# EAGLE schematic Schnittstelle_Swissphone (EAGLE 9.6.1)
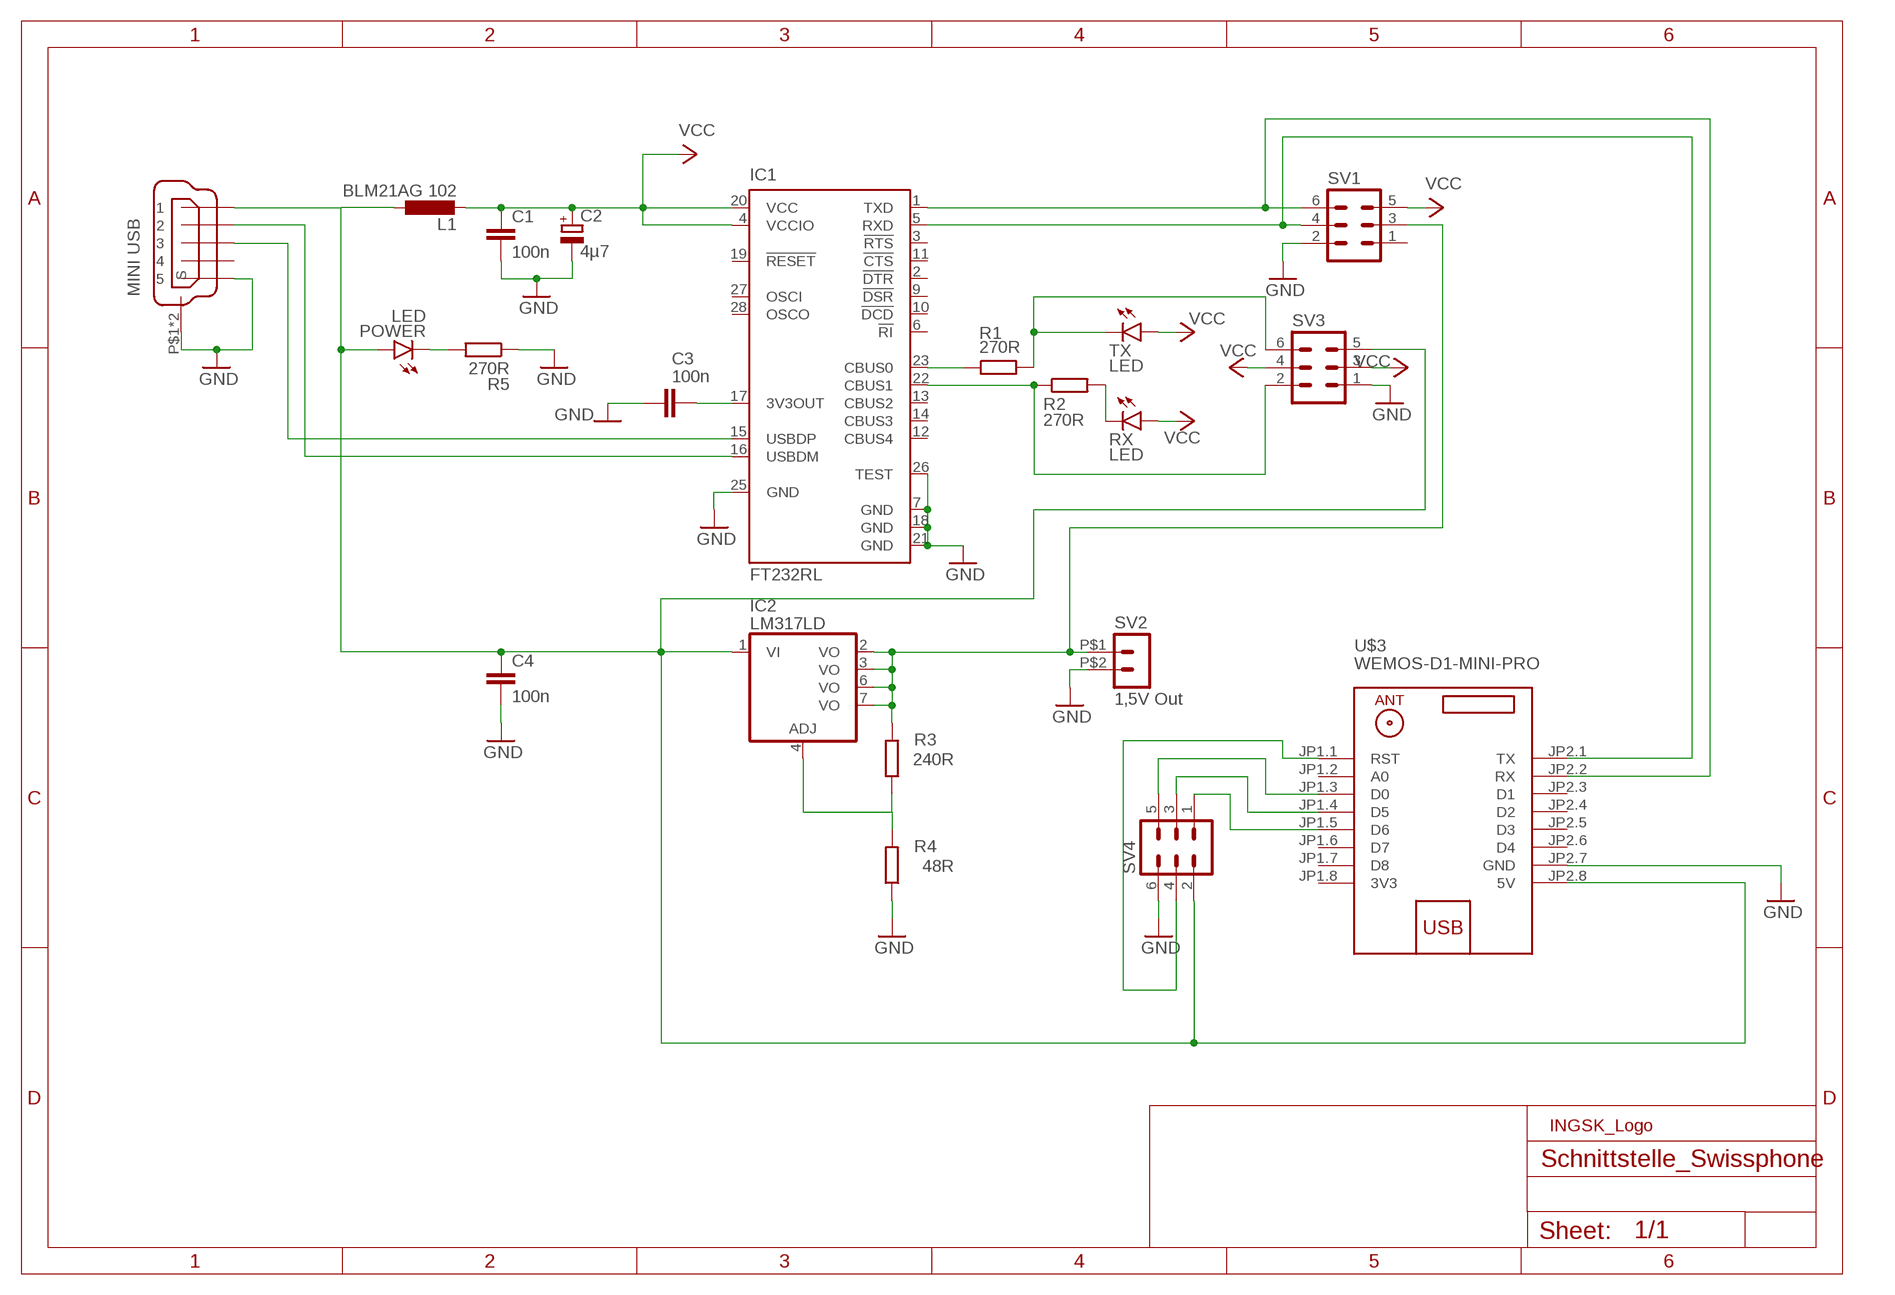
[diagram p0: schematic, sheet 1]

## Parts
C1  100n  C-EUC0603  [C0603]
C2  4µ7  CPOL-EUA/3216-18W  [A/3216-18W]
C3  100n  C-EUC0603  [C0603]
C4  100n  C-EUC0603  [C0603]
IC1  FT232RL  [SSOP28]
IC2  LM317LD  [SO08]
L1  BLM21AG 102  L-EUL2012C  [L2012C]
POWER  LED  LED3MM  [LED3MM]
R1  270R  R-EU_R0603  [R0603]
R2  270R  R-EU_R0603  [R0603]
R3  240R  R-EU_R1206  [R1206]
R4  48R  R-EU_R1206  [R1206]
R5  270R  R-EU_R0603  [R0603]
RX  LED  LED3MM  [LED3MM]
SV1  ML6  [ML6]
SV2  1,5V Out  HEADER_POS2_43650-0200  [43650-0200]
SV3  ML6  [ML6]
SV4  ML6  [ML6]
TX  LED  LED3MM  [LED3MM]
U$1  MINI USB  USBBWM  [USBBWM]
U$2  SK  [INGSK]
U$3  WEMOS-D1-MINI-PRO  [WEMOS-D1-MINI-PRO]

## Nets
GND: C1.2 C2.- C3.2 C4.2 IC1.7(GND) IC1.18(GND) IC1.21(GND) IC1.25(GND) IC1.26(TEST) R4.1 R5.1 SV1.2 SV2.P$2 SV3.1 SV4.6 U$1.P$1(S) U$1.P$2(S) U$1.P$3 U$3.JP2.7(GND)
N$1: IC1.23(CBUS0) R1.1
N$2: IC1.22(CBUS1) R2.1 SV3.2
N$3: R1.2 SV3.6 TX.K(C)
N$4: R2.2 RX.K(C)
N$5: IC1.1(TXD) SV1.6 U$3.JP2.2(RX)
N$6: IC1.5(RXD) SV1.4 U$3.JP2.1(TX)
N$7: IC2.2(VO) IC2.3(VO) IC2.6(VO) IC2.7(VO) R3.2 SV1.3 SV2.P$1
N$8: SV4.1 U$3.JP1.5(D6)
N$9: IC2.4(ADJ) R3.1 R4.2
N$10: C3.1 IC1.17(3V3OUT)
N$11: C4.1 IC2.1(VI) L1.1 POWER.A SV3.5 SV4.2 U$1.P$7 U$3.JP2.8(5V)
N$12: POWER.K(C) R5.2
N$13: IC1.16(USBDM) U$1.P$6
N$14: IC1.15(USBDP) U$1.P$5
N$15: SV4.3 U$3.JP1.4(D5)
N$16: SV4.5 U$3.JP1.3(D0)
N$17: SV4.4 U$3.JP1.1(RST)
VCC: C1.1 C2.+ IC1.4(VCCIO) IC1.20(VCC) L1.2 RX.A SV1.5 SV3.3 SV3.4 TX.A
Unconnected: IC1.2(!DTR) IC1.3(!RTS) IC1.6(!RI) IC1.9(!DSR) IC1.10(!DCD) IC1.11(!CTS) IC1.12(CBUS4) IC1.13(CBUS2) IC1.14(CBUS3) IC1.19(!RESET) IC1.27(OSCI) IC1.28(OSCO) SV1.1 U$1.P$4 U$3.JP1.2(A0) U$3.JP1.6(D7) U$3.JP1.7(D8) U$3.JP2.3(D1) U$3.JP2.4(D2) U$3.JP2.5(D3) U$3.JP2.6(D4)

## Power pins joined to a net without a drawn wire
3V3: U$3.JP1.8(3V3)

## Library data of the parts
C1 C3 C4 = rcl:C-EU: CAPACITOR, European symbol; SPICEPREFIX: C
C2 = rcl:CPOL-EU: POLARIZED CAPACITOR, European symbol; SPICEPREFIX: C
IC1 = ftdichip:FT232R: Source: http://www.ftdichip.com/Documents/DataSheets/DS_FT232R_v104.pdf; MPN: FT232RL; OC_FARNELL: 1146032; OC_NEWARK: 91K9918
IC2 = linear:LM317LD: LOW CURRENT 1.2 TO 37V ADJUSTABLE VOLTAGE REGULATOR Source: http://pdf.alldatasheet.com
L1 = rcl:L-EU: INDUCTOR, European symbol; SPICEPREFIX: L
POWER RX TX = led:LED: LED OSRAM: - CHIPLED LG R971, LG N971, LY N971, LG Q971, LY Q971, LO R971, LY R971 LH N974, LH R974 LS Q976, LO Q976, LY Q976 LO Q996 - Hyper CHIPLED LW Q18S LB Q993, LB Q99A, LB R99A - SideLED LS A670, LO A670, LY A670, LG A670, LP A670 LB A673, LV A673, LT A673, LW A673 LH A674 LY A675 LS A676, LA A676, LO A676, LY A676, LW A676 LS A679, LY A679, LG A679 - Hyper Micro SIDELED® LS Y876, LA Y876, LO Y876, LY Y876 LT Y87S - SmartLED LW L88C, LW L88S LB L89C, LB L89S, LG L890 LS L89K, LO L89K, LY L89K LS L896, LA L896, LO L896, LY L896 - TOPLED LS T670, LO T670, LY T670, LG T670, LP T670 LSG T670, LSP T670, LSY T670, LOP T670, LYG T670 LG T671, LOG T671, LSG T671 LB T673, LV T673, LT T673, LW T673 LH T674 LS T676, LA T676, LO T676, LY T676, LB T676, LH T676, LSB T676, LW T676 LB T67C, LV T67C, LT T67C, LS T67K, LO T67K, LY T67K, LW E67C LS E67B, LA E67B, LO E67B, LY E67B, LB E67C, LV E67C, LT E67C LW T67C LS T679, LY T679, LG T679 LS T770, LO T770, LY T770, LG T770, LP T770 LB T773, LV T773, LT T773, LW T773 LH T774 LS E675, LA E675, LY E675, LS T675 LS T776, LA T776, LO T776, LY T776, LB T776 LHGB T686 LT T68C, LB T68C - Hyper Mini TOPLED® LB M676 - Mini TOPLED Santana® LG M470 LS M47K, LO M47K, LY M47K Source: http://www.osram.convergy.de LUXEON: - LUMILED® LXK2-PW12-R00, LXK2-PW12-S00, LXK2-PW14-U00, LXK2-PW14-V00 LXK2-PM12-R00, LXK2-PM12-S00, LXK2-PM14-U00 LXK2-PE12-Q00, LXK2-PE12-R00, LXK2-PE12-S00, LXK2-PE14-T00, LXK2-PE14-U00 LXK2-PB12-K00, LXK2-PB12-L00, LXK2-PB12-M00, LXK2-PB14-N00, LXK2-PB14-P00, LXK2-PB14-Q00 LXK2-PR12-L00, LXK2-PR12-M00, LXK2-PR14-Q00, LXK2-PR14-R00 LXK2-PD12-Q00, LXK2-PD12-R00, LXK2-PD12-S00 LXK2-PH12-R00, LXK2-PH12-S00 LXK2-PL12-P00, LXK2-PL12-Q00, LXK2-PL12-R00 Source: www.luxeon.com KINGBRIGHT: KA-3528ASYC Source: www.kingbright.com
R1-R5 = rcl:R-EU_: RESISTOR, European symbol; SPICEPREFIX: R
SV1 SV3 SV4 = con-harting-ml:ML6: HARTING; OC_FARNELL: unknown; OC_NEWARK: unknown
SV2 = con-molex-micro-fit-3_0:HEADER_POS2_?: Molex - Micro-Fit 3.0 Series connector, 3.00mm (0.118") pitch header, 2 positions.
U$1 = simon:USBBWM
U$2 = EigeneLogos:SK
U$3 = diy-modules:WEMOS-D1-MINI-PRO: WEMOS D1 mini Pro: Mini Wi-Fi Board based on ESP-8266EX chip More details can be found here: https://www.wemos.cc/product/d1-mini-pro.html Click here to find device on ebay.com <http://www.ebay.com/sch/wemos+d1+mini+pro>